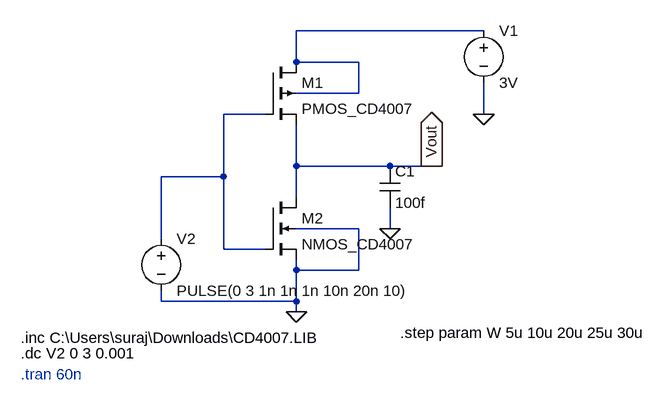
[diagram p0: schematic CMOS_Inverter(CD4007).asc]
CMOS_Inverter(CD4007).asc, the LTspice schematic file:
Version 4
SHEET 1 880 680
WIRE 464 16 176 16
WIRE 176 64 176 16
WIRE 272 64 176 64
WIRE 272 112 272 64
WIRE 272 112 176 112
WIRE 128 144 64 144
WIRE 464 144 464 96
WIRE 176 224 176 160
WIRE 320 224 176 224
WIRE 384 224 320 224
WIRE 400 224 384 224
WIRE 64 240 64 144
WIRE 64 240 -32 240
WIRE 176 272 176 224
WIRE 272 320 176 320
WIRE 320 320 320 288
WIRE -32 336 -32 240
WIRE 64 352 64 240
WIRE 128 352 64 352
WIRE 176 384 176 368
WIRE 272 384 272 320
WIRE 272 384 176 384
WIRE -32 432 -32 416
WIRE 176 432 176 384
WIRE 176 432 -32 432
WIRE 176 448 176 432
FLAG 176 448 0
FLAG 320 320 0
FLAG 384 224 Vout
IOPIN 384 224 Out
FLAG 464 144 0
SYMBOL pmos4 128 64 R0
SYMATTR InstName M1
SYMATTR Value PMOS_CD4007
SYMATTR Value2 l=5u w=100u
SYMBOL nmos4 128 272 R0
SYMATTR InstName M2
SYMATTR Value NMOS_CD4007
SYMATTR Value2 l=5u w=170u
SYMBOL voltage 464 0 R0
WINDOW 123 0 0 Left 0
WINDOW 39 0 0 Left 0
SYMATTR InstName V1
SYMATTR Value 3V
SYMBOL voltage -32 320 R0
WINDOW 123 0 0 Left 0
WINDOW 39 0 0 Left 0
SYMATTR InstName V2
SYMATTR Value PULSE(0 3 1n 1n 1n 10n 20n 10)
SYMBOL cap 304 224 R0
SYMATTR InstName C1
SYMATTR Value 100f
TEXT -248 488 Left 2 !.inc C:\\Users\\suraj\\Downloads\\CD4007.LIB
TEXT -248 512 Left 2 !.dc V2 0 3 0.001
TEXT -248 544 Left 2 ;.tran 60n
TEXT 336 480 Left 2 !.step param W 5u 10u 20u 25u 30u

The netlist it stands for:
* CMOS_Inverter(CD4007).asc
M1 N001 N002 Vout N001 PMOS_CD4007 l=5u w=100u
M2 Vout N002 0 0 NMOS_CD4007 l=5u w=170u
V1 N001 0 3V
V2 N002 0 PULSE(0 3 1n 1n 1n 10n 20n 10)
C1 Vout 0 100f
.model NMOS NMOS
.model PMOS PMOS
.lib standard.mos
.inc C:\Users\suraj\Downloads\CD4007.LIB
.dc V2 0 3 0.001
* .tran 60n
.step param W 5u 10u 20u 25u 30u
.backanno
.end